# EasyEDA schematic Schematic.json
TITLE: New Schematic; REV: 1.0; Date: 2017-11-23; Sheet: 1/1; Drawn By: jaei
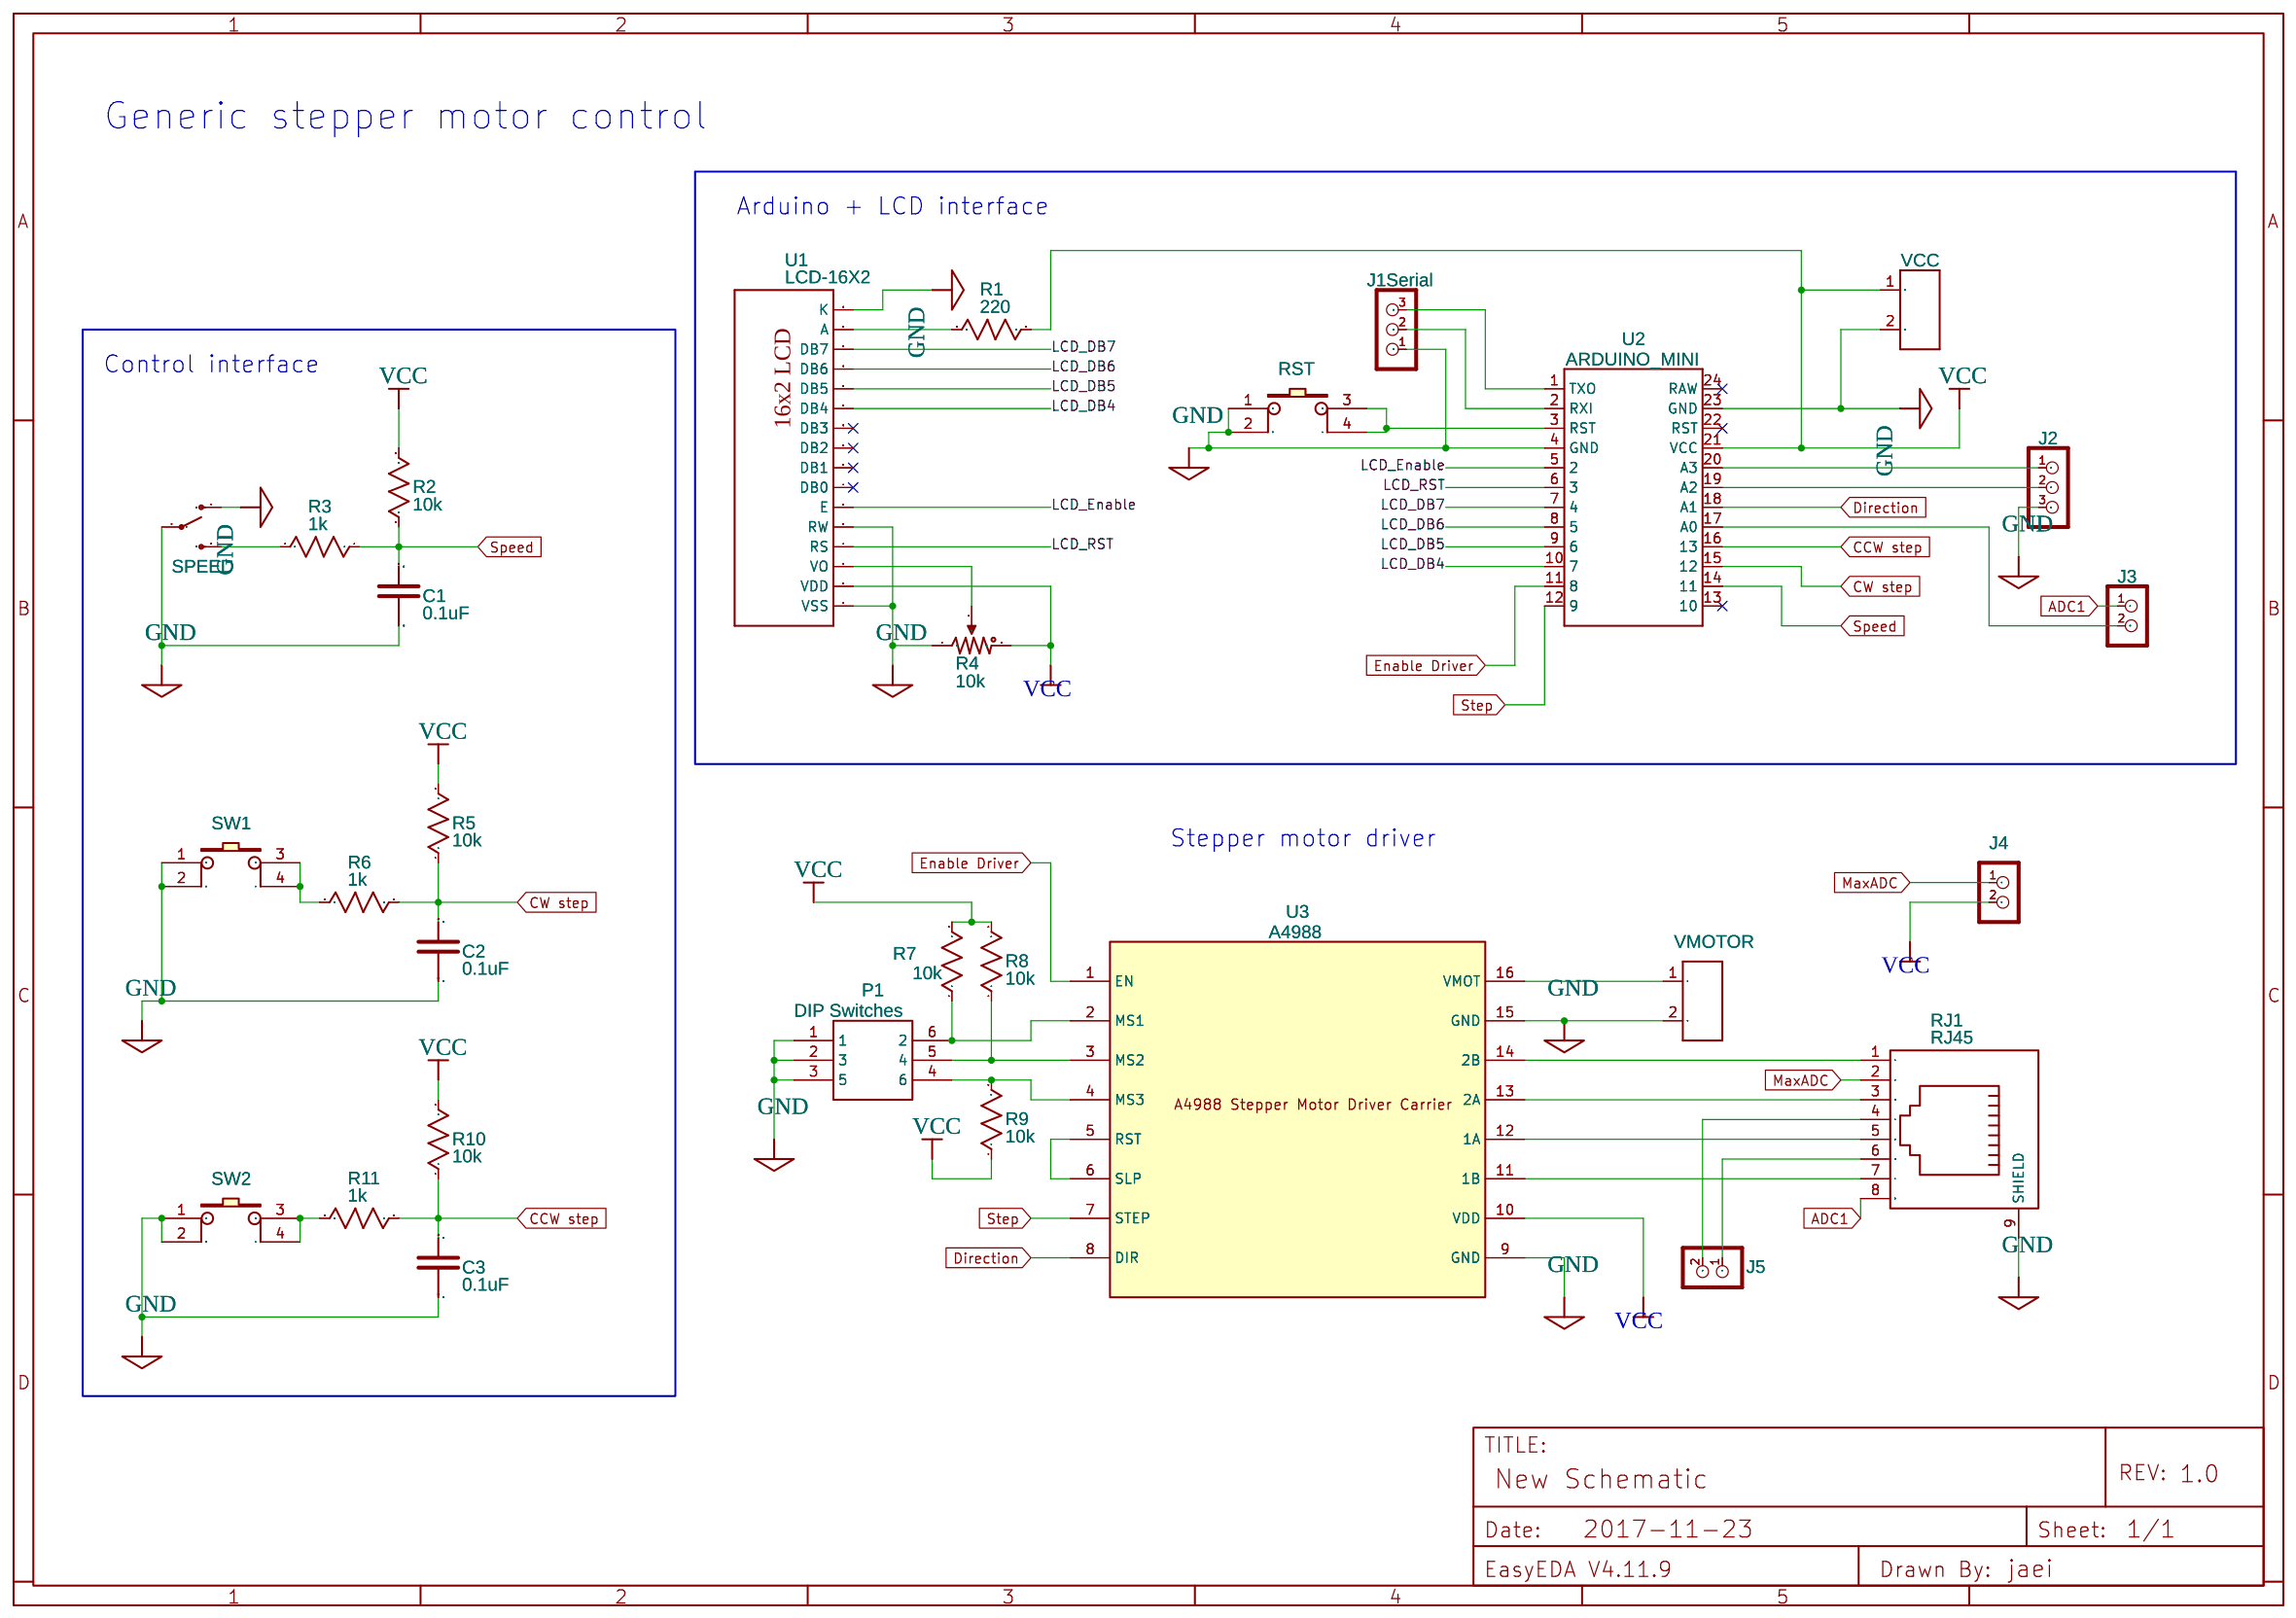
[diagram p0: schematic sheet]

## Parts
C1  0.1uF  [TWO_IO]
C2  0.1uF  [TWO_IO]
C3  0.1uF  [TWO_IO]
J1-SERIAL  J1Serial  [M1X3]
J2  CON_HEADER_1X03-PTH  [M1X3]
J3  CON_HEADER_1X02-PTH  [M1X2]
J4  CON_HEADER_1X02-PTH  [M1X2]
J5  CON_HEADER_1X02-PTH  [M1X2]
P1  DIP Switches  [DIP-6__300_ELL]
R1  220  [AXIAL-0.3]
R2  10k  [AXIAL-0.3]
R3  1k  [AXIAL-0.3]
R4  10k  [RES-ADJ_3386P]
R5  10k  [AXIAL-0.3]
R6  1k  [AXIAL-0.3]
R7  10k  [AXIAL-0.3]
R8  10k  [AXIAL-0.3]
R9  10k  [AXIAL-0.3]
R10  10k  [AXIAL-0.3]
R11  1k  [AXIAL-0.3]
RJ1  RJ45  [RJ45-3.68]
RST  SWITCH-6x6x5_TH  [SWITCH-6X6X5_TH]
SPEED  SWITCH-SPDT  [SWITCH-SPDT]
SW1  SWITCH-6x6x5_TH  [SWITCH-6X6X5_TH]
SW2  SWITCH-6x6x5_TH  [SWITCH-6X6X5_TH]
U1  LCD-16X2  [LCD-1602]
U2  ARDUINO_MINI  [ARDUINO_MINI]
U3  A4988  [A4988 STEPPER MOTOR DRIVER CARRIER]
VCC  GS009S-2P-2  [H2-5.0-10.5X8.0MM]
VMOTOR  GS009S-2P-2  [H2-5.0-10.5X8.0MM]

## Library data of the parts
C1-C3 = -: catid: 20; Manufacturer Part: ?
J1-SERIAL J2-J5 = -: catid: 20; Contributor: DangerousPrototype; Manufacturer Part: ?
P1 = -: Supplier: LCSC; Manufacturer: LCSC; Manufacturer Part: HDR-IDC-2.54-2X3P; Supplier Part: C11214
R1-R3 R5-R11 = Resistor: Manufacturer Part: ?
R4 = Potentiometer: K(%): 50; Manufacturer Part: ?
RJ1 = -: Supplier: LCSC; Manufacturer: LCSC; Supplier Part: C36373
RST SW1 SW2 = -: Supplier: LCSC; Manufacturer: LCSC; Supplier Part: C69330
SPEED U1 = -: catid: 20; Contributor: SparkFun; Manufacturer Part: ?
U2 = -: Arduino Pro Mini footprint; catid: 20; Contributor: SparkFun; Manufacturer Part: ?
U3 = -: Contributor: winter2015; sourceId: YsmgyP7pj; Manufacturer Part: ?
VCC VMOTOR = -: DIP Blue Screw Terminal;; catid: 20

## Nets
GND: C1.P$2 C2.P$2 C3.P$2 J1-SERIAL.1 J2.3 P1.1 P1.2(3) P1.3(5) R4.1 RJ1.9(SHIELD) RST.1 RST.2 SPEED.1(O) SPEED.2(P) SW1.1 SW1.2 SW2.1 SW2.2 U1.1(VSS) U1.5(RW) U1.16(K) U2.4(GND) U2.23(GND) U3.9(GND) U3.15(GND) VCC.2 VMOTOR.2
VCC: J4.2 R1.1 R2.2 R4.3(2) R5.2 R7.2 R8.2 R9.1 R10.2 U1.2(VDD) U2.21(VCC) U3.10(VDD) VCC.1
ADC1: J3.1 RJ1.8
CCW step: C3.P$1 R10.1 R11.1 U2.16(13)
CW step: C2.P$1 R5.1 R6.2 U2.15(12)
Direction: U2.18(A1) U3.8(DIR)
Enable Driver: U2.11(8) U3.1(EN)
LCD_DB4: U1.11(DB4) U2.10(7)
LCD_DB5: U1.12(DB5) U2.9(6)
LCD_DB6: U1.13(DB6) U2.8(5)
LCD_DB7: U1.14(DB7) U2.7(4)
LCD_Enable: U1.6(E) U2.5(2)
LCD_RST: U1.4(RS) U2.6(3)
MaxADC: J4.1 RJ1.2
Speed: C1.P$1 R2.1 R3.1 U2.14(11)
Step: U2.12(9) U3.7(STEP)
R6_1: R6.1 SW1.3 SW1.4
R11_2: R11.2 SW2.3 SW2.4
RJ1_4: J5.2 RJ1.4
RJ1_6: J5.1 RJ1.6
SPEED_3: R3.2 SPEED.3(S)
U1_3: R4.2(3) U1.3(VO)
U1_15: R1.2 U1.15(A)
U2_1: J1-SERIAL.3 U2.1(TXO)
U2_2: J1-SERIAL.2 U2.2(RXI)
U2_3: RST.3 RST.4 U2.3(RST)
U2_17: J3.2 U2.17(A0)
U2_19: J2.2 U2.19(A2)
U2_20: J2.1 U2.20(A3)
U3_2: P1.6(2) R7.1 U3.2(MS1)
U3_3: P1.5(4) R8.1 U3.3(MS2)
U3_4: P1.4(6) R9.2 U3.4(MS3)
U3_5: U3.5(RST) U3.6(SLP)
U3_11: RJ1.7 U3.11(1B)
U3_12: RJ1.5 U3.12(1A)
U3_13: RJ1.3 U3.13(2A)
U3_14: RJ1.1 U3.14(2B)
U3_16: U3.16(VMOT) VMOTOR.1

Not connected (* = marked no-connect by the designer): U1 7(DB0)* 8(DB1)* 9(DB2)* 10(DB3)*; U2 13(10)* 22(RST)* 24(RAW)*

## Notes on the sheet
- Generic stepper motor control
- Arduino + LCD interface
- Control interface
- Stepper motor driver
